# EasyEDA Pro project ECU_Project.epro, board PCB5
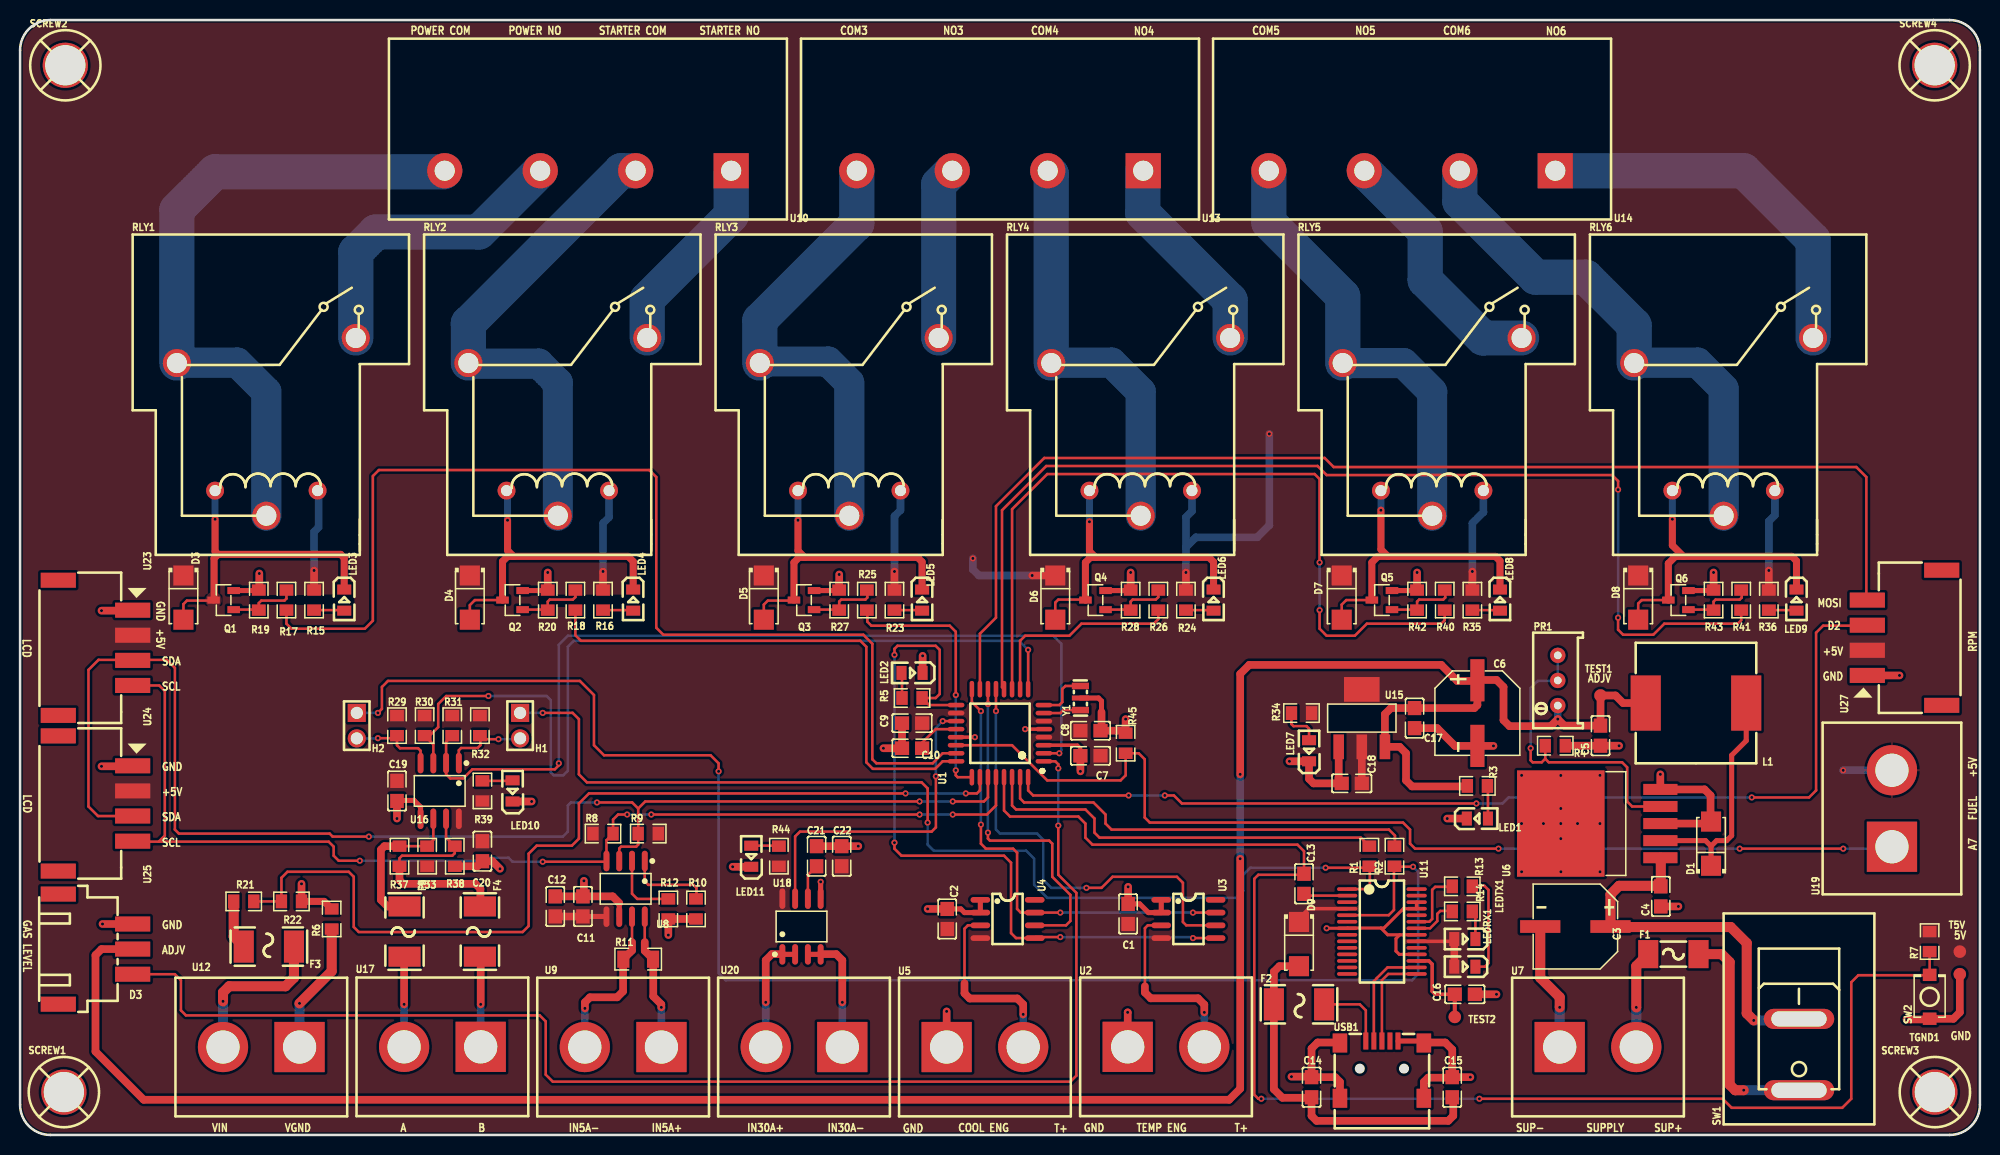
[diagram p4: board, top side]
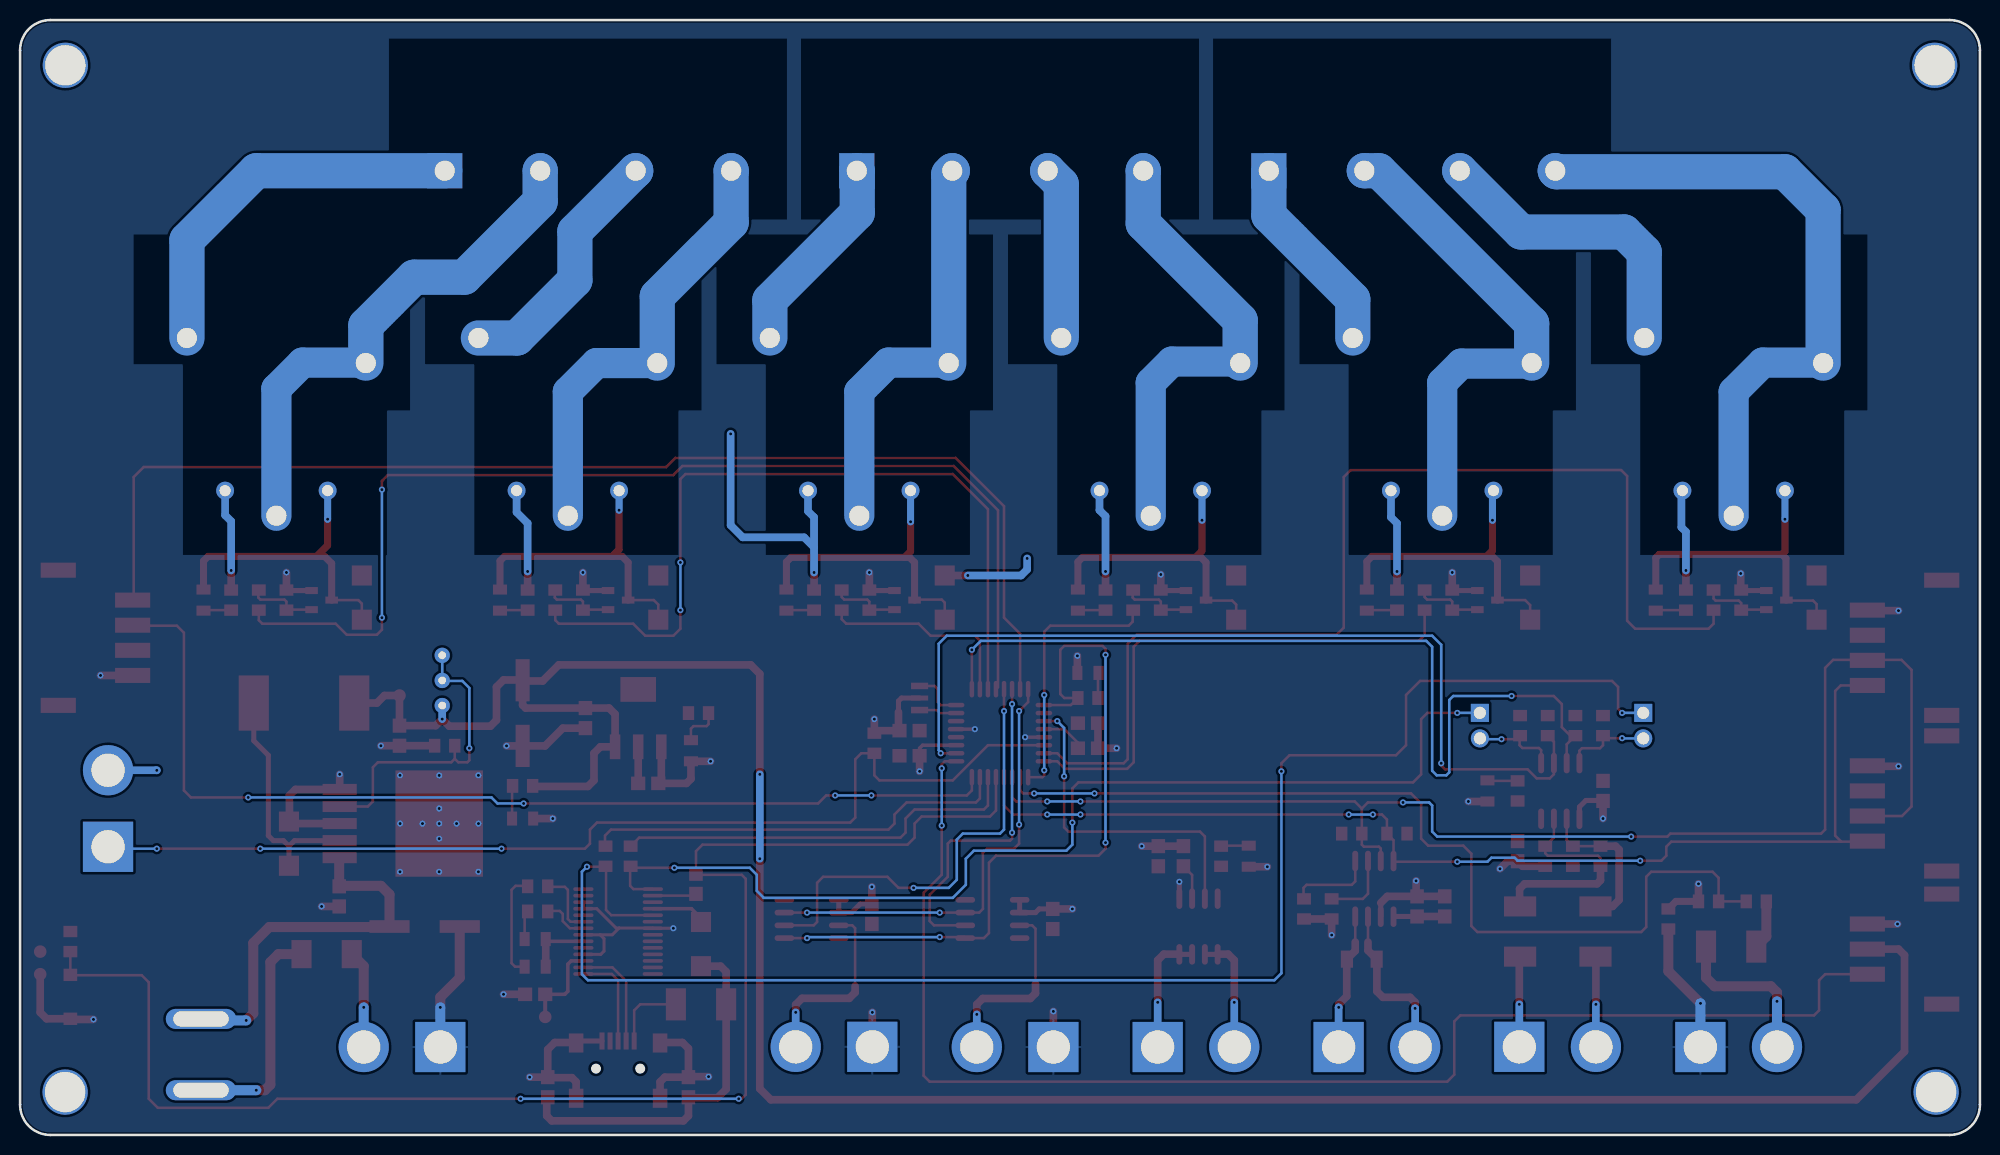
[diagram p5: board, bottom side, seen from below]

Outline 195 x 111 mm; copper layers: Top Layer, Bottom Layer. Coordinates in mm from the lower left corner of the outline.
Outline path: 0,108 0,3 arc(0.88,0.88) 3,0 192,0 arc(194.12,0.88) 195,3 195,108 arc(194.12,110.12) 192,111 3,111 arc(0.88,110.12) 0,108
Stack: Top Layer 0.035mm / Dielectric1 1.51mm FR4 er 4.5 / Bottom Layer 0.035mm

## Design rules (mm)
template: Custom Config
spacing copperThickness1oz (default): track to track 0.254, other pairs 0.152 to 0.3
spacing copperThickness2oz: track to track 0.203, other pairs 0.152 to 0.3
track width copperThickness1oz (default): min 0.127, default 0.254, max 4.1
track width copperThickness2oz: min 0.203, default 0.762, max 2.54
differential pair differentialPair (default): width min 0.127, default 0.254, max 2.54; gap min 0.152, default 0.152
via viaSize (default): diameter min 0.5, default 0.61, max 10; hole min 0.3, default 0.305, max 6.3
net +5V uses copperThickness2oz
net GND uses copperThickness2oz
net +ADJV uses copperThickness2oz

## Placement (name value [footprint] x y rotation side)
C1  100nF  [C0805]  110.25 22 270 top
C2  100nF  [C0805]  92.25 21.5 270 top
C3  100uF  [CAP-SMD_BD8.0-L8.3-W8.3-LS10.0-FD]  154.75 20.75 180 top
C4  100nF  [C0805]  163.25 23.75 90 top
C5  100nF  [C0805]  157.25 39.75 90 top
C6  220uF  [CAP-SMD_BD8.0-L8.3-W8.3-FD]  145 42 270 top
C7  1uF  [C0805]  106.5 37.75 0 top
C8  4.7uF  [C0805]  106.5 40.25 180 top
C9  1uF  [C0805]  88.75 41 0 top
C10  100nF  [C0805]  88.75 38.5 0 top
C11  10uF  [C0805]  56 22.75 270 top
C12  100nF  [C0805]  53.25 22.75 270 top
C13  100nF  [C0805]  127.75 25 270 top
C14  4.7uF  [C0805]  128.5 4.75 270 top
C15  100nF  [C0805]  142.5 4.75 270 top
C16  100nF  [C0805]  143.75 14 180 top
C17  22uF  [C0805]  138.75 41.5 90 top
C18  22uF  [C0805]  132.5 35 0 top
C19  10uF  [C0805]  37.5 34.25 90 top
C20  100nF  [C0805]  46 28.25 90 top
C21  1nF  [C0805]  79.25 27.75 270 top
C22  100nF  [C0805]  81.75 27.75 270 top
D1  SS34  [SMA_L4.3-W2.6-LS5.2-RD]  168.25 29 90 top
D3  SS34  [SMA_L4.3-W2.6-LS5.2-RD]  16.25 53.5 270 top
D4  SS34  [SMA_L4.3-W2.6-LS5.2-RD]  44.75 53.5 270 top
D5  SS34  [SMA_L4.3-W2.6-LS5.2-RD]  74 53.5 270 top
D6  SS34  [SMA_L4.3-W2.6-LS5.2-RD]  103 53.5 270 top
D7  SS34  [SMA_L4.3-W2.6-LS5.2-RD]  131.5 53.5 270 top
D8  SS34  [SMA_L4.3-W2.6-LS5.2-RD]  161 53.5 270 top
D9  SS34  [SMA_L4.3-W2.6-LS5.2-RD]  127.25 19 270 top
F1  TA2VT3  [FUSE-SMD_L6.1-W2.5]  164.5 18 0 top
F2  TA2VT1  [F2410]  127.25 13 0 top
F3  TA2VT1  [F2410]  24.75 18.75 180 top
F4  TA2VT1  [F2410]  45.75 20.25 270 top
F5  TA2VT1  [F2410]  38.25 20.25 270 top
H1  -  [HDR-TH_2P-P2.54-V-M-2]  49.75 40.75 180 top
H2  -  [HDR-TH_2P-P2.54-V-M-2]  33.5 40.75 180 top
L1  47uH  [IND-SMD_L12.0-W12.0_CDRH127NP]  166.75 43 180 top
LED1  KT-0805W  [LED0805-R-RD]  145 31.5 0 top
LED2  KT-0805G  [LED0805-R-RD]  88.75 46 180 top
LED3  KT-0805W  [LED0805-R-RD]  32.25 53.25 270 top
LED4  KT-0805W  [LED0805-R-RD]  61 53.25 270 top
LED5  KT-0805W  [LED0805-R-RD]  89.75 53.25 270 top
LED6  KT-0805W  [LED0805-R-RD]  118.75 53.25 270 top
LED7  KT-0805W  [LED0805-R-RD]  128.25 38.25 90 top
LED8  KT-0805W  [LED0805-R-RD]  147.25 53.25 270 top
LED9  KT-0805W  [LED0805-R-RD]  176.75 53.25 270 top
LED10  KT-0805G  [LED0805-R-RD]  49 34.25 90 top
LED11  KT-0805W  [LED0805-R-RD]  72.75 27.75 90 top
LEDRX1  KT-0805Y  [LED0805-R-RD]  143.75 16.75 180 top
LEDTX1  KT-0805Y  [LED0805-R-RD]  143.75 19.5 180 top
PR1  10kΩ  [RES-ADJ-TH_3P-L10.0-W10.0-P2.50-L]  153 45.25 90 top
Q1  AO3400A  [SOT-23-3_L2.9-W1.3-P1.90-LS2.4-BR]  20.25 53.25 0 top
Q2  AO3400A  [SOT-23-3_L2.9-W1.3-P1.90-LS2.4-BR]  49 53.25 0 top
Q3  AO3400A  [SOT-23-3_L2.9-W1.3-P1.90-LS2.4-BR]  78 53.25 0 top
Q4  AO3400A  [SOT-23-3_L2.9-W1.3-P1.90-LS2.4-BR]  107 53.25 0 top
Q5  AO3400A  [SOT-23-3_L2.9-W1.3-P1.90-LS2.4-BR]  135.5 53.25 0 top
Q6  AO3400A  [SOT-23-3_L2.9-W1.3-P1.90-LS2.4-BR]  165 53.25 0 top
R1  1kΩ  [R0805]  134.25 27.75 90 top
R2  1kΩ  [R0805]  136.75 27.75 90 top
R3  1kΩ  [R0805]  145 34.75 180 top
R4  330Ω  [R0805]  152.75 38.75 180 top
R5  1kΩ  [R0805]  88.75 43.5 0 top
R6  1kΩ  [R0805]  31 21.5 90 top
R7  1kΩ  [R0805]  190 19.25 90 top
R8  10kΩ  [R0805]  58 30 0 top
R9  10kΩ  [R0805]  62.5 30 0 top
R10  10kΩ  [R0805]  67.25 22.5 270 top
R11  100mΩ  [R1206]  61.5 17.5 0 top
R12  10kΩ  [R0805]  64.5 22.5 270 top
R13  1kΩ  [R0805]  143.5 24.75 0 top
R14  1kΩ  [R0805]  143.5 22.25 0 top
R15  1kΩ  [R0805]  29.25 53.25 90 top
R16  1kΩ  [R0805]  58 53.25 90 top
R17  1kΩ  [R0805]  26.5 53.25 90 top
R18  1kΩ  [R0805]  55.25 53.25 90 top
R19  10kΩ  [R0805]  23.75 53.25 90 top
R20  10kΩ  [R0805]  52.5 53.25 90 top
R21  68kΩ  [R0805]  22.25 23.25 180 top
R22  7.5kΩ  [R0805]  27 23.25 180 top
R23  1kΩ  [R0805]  87 53.25 90 top
R24  1kΩ  [R0805]  116 53.25 90 top
R25  1kΩ  [R0805]  84.25 53.25 90 top
R26  1kΩ  [R0805]  113.25 53.25 90 top
R27  10kΩ  [R0805]  81.5 53.25 90 top
R28  10kΩ  [R0805]  110.5 53.25 90 top
R29  10kΩ  [R0805]  37.5 40.75 90 top
R30  10kΩ  [R0805]  40.25 40.75 90 top
R31  10kΩ  [R0805]  43 40.75 90 top
R32  10kΩ  [R0805]  45.75 40.75 90 top
R33  20kΩ  [R0805]  40.5 27.75 270 top
R34  1kΩ  [R0805]  127.5 42 0 top
R35  1kΩ  [R0805]  144.5 53.25 90 top
R36  1kΩ  [R0805]  174 53.25 90 top
R37  120Ω  [R0805]  37.75 27.75 90 top
R38  20kΩ  [R0805]  43.25 27.75 90 top
R39  1kΩ  [R0805]  46 34.25 270 top
R40  1kΩ  [R0805]  141.75 53.25 90 top
R41  1kΩ  [R0805]  171.25 53.25 90 top
R42  10kΩ  [R0805]  139 53.25 90 top
R43  10kΩ  [R0805]  168.5 53.25 90 top
R44  1kΩ  [R0805]  75.5 27.75 270 top
R45  220Ω  [R0805]  110 39 90 top
RLY1  SLA-5VDC-SL-A  [RELAY-TH_SLA-XXVDC-SL-A]  24.5 70.5 0 top
RLY2  SLA-5VDC-SL-A  [RELAY-TH_SLA-XXVDC-SL-A]  53.5 70.5 0 top
RLY3  SLA-5VDC-SL-A  [RELAY-TH_SLA-XXVDC-SL-A]  82.5 70.5 0 top
RLY4  SLA-5VDC-SL-A  [RELAY-TH_SLA-XXVDC-SL-A]  111.5 70.5 0 top
RLY5  SLA-5VDC-SL-A  [RELAY-TH_SLA-XXVDC-SL-A]  140.5 70.5 0 top
RLY6  SLA-5VDC-SL-A  [RELAY-TH_SLA-XXVDC-SL-A]  169.5 70.5 0 top
SCREW1  -  [Screw-Hole-M4]  4.36 4.26 0 top
SCREW2  -  [Screw-Hole-M4]  4.5 106.5 0 top
SCREW3  -  [Screw-Hole-M4]  190.52 4.26 0 top
SCREW4  -  [Screw-Hole-M4]  190.5 106.5 0 top
SW1  MR1-110-C5N-BBAA  [SW-TH_MR1-110-C5N-BBAA]  177 8 90 top
SW2  TS-1088R-02026  [SW-SMD_L3.9-W3.0-P4.45]  190 13.75 90 top
T5V  -  [Test-Point-0.5mm]  193 18.25 0 top
TEST1  -  [Test-Point-0.5mm]  157.25 43.75 0 top
TEST2  -  [Test-Point-0.5mm]  142.75 11.75 0 top
TGND1  -  [Test-Point-0.5mm]  193 16 0 top
U1  ATMEGA328P-AU  [TQFP-32_L7.0-W7.0-P0.80-LS9.0-BL]  97.5 40 90 top
U2  KF25H-7.62-2P  [CONN-TH_KF25H-7.62-2P]  114.02 8.77 0 top
U3  MAX6675ISA+  [SOIC-8_L5.0-W4.0-P1.27-LS6.0-BL]  116.25 21.5 270 top
U4  MAX6675ISA+  [SOIC-8_L5.0-W4.0-P1.27-LS6.0-BL]  98.25 21.5 270 top
U5  KF25H-7.62-2P  [CONN-TH_KF25H-7.62-2P]  96 8.75 0 top
U6  LM2596S-ADJRG  [TO-263-5_L10.2-W8.6-P1.70-LS14.4-TL]  158.25 31 180 top
U7  KF25H-7.62-2P  [CONN-TH_KF25H-7.62-2P]  157 8.75 0 top
U8  INA219AIDR  [SOIC-8_L4.9-W3.9-P1.27-LS6.0-BL]  60.25 24.5 180 top
U9  KF25H-7.62-2P  [CONN-TH_KF25H-7.62-2P]  60 8.75 180 top
U10  HB9500-9.5-4P  [CONN-TH_HB9500-9.5-4P]  56.5 96 180 top
U11  FT232RL  [SSOP-28_L10.2-W5.3-P0.65-LS7.8-BL]  135.5 20.25 270 top
U12  KF25H-7.62-2P  [CONN-TH_KF25H-7.62-2P]  24 8.75 180 top
U13  HB9500-9.5-4P  [CONN-TH_HB9500-9.5-4P]  97.5 96 180 top
U14  HB9500-9.5-4P  [CONN-TH_HB9500-9.5-4P]  138.5 96 180 top
U15  AMS1117-5.0  [SOT-223_L6.5-W3.5-P2.30-LS7.0-BR]  133.5 41.5 270 top
U16  MAX485CSA+T  [SOIC-8_L4.9-W3.9-P1.27-LS6.0-BL]  41.75 34.25 180 top
U17  KF25H-7.62-2P  [CONN-TH_KF25H-7.62-2P]  42.02 8.77 180 top
U18  ACS712ELCTR-20A-T  [SOIC-8_L4.9-W3.9-P1.27-LS6.0-BL]  77.75 20.75 0 top
U19  KF25H-7.62-2P  [CONN-TH_KF25H-7.62-2P]  186.25 32.5 90 top
U20  KF25H-7.62-2P  [CONN-TH_KF25H-7.62-2P]  78 8.75 180 top
U23  BX-XH2.54-4PWT  [CONN-SMD_4P-P2.50_BX-XH2.54-4PWT]  7.5 48.5 270 top
U24  BX-XH2.54-4PWT  [CONN-SMD_4P-P2.50_BX-XH2.54-4PWT]  7.5 33 270 top
U25  BX-XH2.54-3PWT  [CONN-SMD_3P-P2.50_BX-XH2.54-3PWT]  7.5 18.5 270 top
U27  BX-XH2.54-4PWT  [CONN-SMD_4P-P2.50_BX-XH2.54-4PWT]  187.5 49.5 90 top
USB1  UX-144S-ACP5  [MINI-USB-SMD_UX-144S-ACP5]  135.5 6.5 0 top
Y1  16MHz  [OSC-SMD_3P-L3.2-W1.3-P1.2-L]  105.5 43.5 90 top

## Footprints (pads in the part's own frame, mm; a bottom-side part is the same pattern mirrored in y, then rotated)
C0805
  rect 1.41x1.35 smd: 1(-1,0) 2(1,0)
CAP-SMD_BD8.0-L8.3-W8.3-FD
  rect 4.2x1.4 smd: 1(-3.267,0) 2(3.267,0)
CAP-SMD_BD8.0-L8.3-W8.3-LS10.0-FD
  rect 4x1.26 smd: 1(-3.495,0) 2(3.495,0)
CONN-SMD_3P-P2.50_BX-XH2.54-3PWT
  rect 1.5x3.5 smd: 1(-2.5,3.7) 2(0,3.7) 3(2.5,3.7) 4(5.48,-3.7) 5(-5.48,-3.7)
CONN-SMD_4P-P2.50_BX-XH2.54-4PWT
  rect 1.5x3.5 smd: 1(-3.75,3.7) 2(-1.25,3.7) 3(1.25,3.7) 4(3.75,3.7) 5(6.73,-3.7) 6(-6.73,-3.7)
CONN-TH_HB9500-9.5-4P
  rect 3.5x3.5 hole 2: 1(-14.25,0)
  round 3.5 hole 2: 2(-4.75,0) 3(4.75,0) 4(14.25,0)
CONN-TH_KF25H-7.62-2P
  rect 5x5 hole 3.3: 1(-3.81,0)
  round 5 hole 3.3: 2(3.81,0)
F2410
  rect 2x3.2 smd: 1(-2.5,0) 2(2.5,0)
FUSE-SMD_L6.1-W2.5
  rect 2x2.8 smd: 1(-2.5,0) 2(2.5,0)
HDR-TH_2P-P2.54-V-M-2
  rect 1.8x1.8 hole 1.2: 1(0,-1.27)
  round 1.8 hole 1.2: 2(0,1.27)
IND-SMD_L12.0-W12.0_CDRH127NP
  rect 3x5.5 smd: 1(-5,0) 2(5,0)
LED0805-R-RD
  rect 1x1.399 smd: 1(1.05,0) 2(-1.05,0)
MINI-USB-SMD_UX-144S-ACP5
  rect 0.5x1.7 smd: 1(-1.6,2.85) 2(-0.8,2.85) 3(0,2.85) 4(0.8,2.85) 5(1.6,2.85)
  rect 1.45x1.9 smd: 6(-4.175,2.65) 7(-4.175,-2.85) 8(4.175,-2.85) 9(4.175,2.65)
OSC-SMD_3P-L3.2-W1.3-P1.2-L
  rect 0.65x1.7 smd: 1(-1.2,0) 3(1.2,0)
  rect 0.5x1.7 smd: 2(0,0)
R0805
  rect 1.133x1.377 smd: 1(-1,0) 2(1,0)
R1206
  rect 1.208x1.701 smd: 1(-1.479,0) 2(1.479,0)
RELAY-TH_SLA-XXVDC-SL-A
  round 2.794 hole 2.002: 2(8.9,8.85)
  round 1.778 hole 1.103: 3(5.1,-6.349) 4(-5.1,-6.349)
  round 2.794 hole 2: 5(-8.9,6.351) 5(0,-8.85)
RES-ADJ-TH_3P-L10.0-W10.0-P2.50-L
  round 1.524 hole 0.762: 1(-2.5,0) 2(0,0) 3(2.5,0)
Screw-Hole-M4
  round 4.5 hole 4: 1(0,0)
SMA_L4.3-W2.6-LS5.2-RD
  rect 2x2 smd: 1(-2.2,0) 2(2.2,0)
SOIC-8_L4.9-W3.9-P1.27-LS6.0-BL
  oval 0.588x2.045 smd: 1(-1.905,-2.772) 2(-0.635,-2.772) 3(0.635,-2.772) 4(1.905,-2.772) 5(1.905,2.772) 6(0.635,2.772) 7(-0.635,2.772) 8(-1.905,2.772)
SOIC-8_L5.0-W4.0-P1.27-LS6.0-BL
  oval 0.569x1.95 smd: 1(-1.905,-2.705) 2(-0.635,-2.705) 3(0.635,-2.705) 4(1.905,-2.705) 5(1.905,2.705) 6(0.635,2.705) 7(-0.635,2.705) 8(-1.905,2.705)
SOT-23-3_L2.9-W1.3-P1.90-LS2.4-BR
  rect 1.25x0.7 smd: 1(1,-0.95) 2(1,0.95) 3(-1,0)
SOT-223_L6.5-W3.5-P2.30-LS7.0-BR
  rect 2.465x1.05 smd: 1(2.857,-2.3) 2(2.857,0) 3(2.857,2.3)
  rect 2.465x3.54 smd: 4(-2.857,0)
SSOP-28_L10.2-W5.3-P0.65-LS7.8-BL
  oval 0.364x2.015 smd: 1(-4.225,-3.455) 2(-3.575,-3.455) 3(-2.925,-3.455) 4(-2.275,-3.455) 5(-1.625,-3.455) 6(-0.975,-3.455) 7(-0.325,-3.455) 8(0.325,-3.455) 9(0.975,-3.455) 10(1.625,-3.455) 11(2.275,-3.455) 12(2.925,-3.455) 13(3.575,-3.455) 14(4.225,-3.455) 15(4.225,3.455) 16(3.575,3.455) 17(2.925,3.455) 18(2.275,3.455) 19(1.625,3.455) 20(0.975,3.455) 21(0.325,3.455) 22(-0.325,3.455) 23(-0.975,3.455) 24(-1.625,3.455) 25(-2.275,3.455) 26(-2.925,3.455) 27(-3.575,3.455) 28(-4.225,3.455)
SW-SMD_L3.9-W3.0-P4.45
  rect 1.23x1.36 smd: 1(-2.185,0) 2(2.185,0)
SW-TH_MR1-110-C5N-BBAA
  oval 2x7 hole 1.5x5.5: 1(-3.55,0) 2(3.55,0)
Test-Point-0.5mm
  round 1.25 smd: 1(0,0)
TO-263-5_L10.2-W8.6-P1.70-LS14.4-TL
  rect 3.4x1.1 smd: 1(-4.953,3.4) 2(-4.953,1.7) 3(-4.953,0) 4(-4.953,-1.7) 5(-4.953,-3.4)
  rect 8.705x10.587 smd: 6(4.953,0)
TQFP-32_L7.0-W7.0-P0.80-LS9.0-BL
  oval 0.45x1.65 smd: 1(-2.8,-4.369) 2(-2,-4.369) 3(-1.2,-4.369) 4(-0.4,-4.369) 5(0.4,-4.369) 6(1.2,-4.369) 7(2,-4.369) 8(2.8,-4.369) 17(2.8,4.369) 18(2,4.369) 19(1.2,4.369) 20(0.4,4.369) 21(-0.4,4.369) 22(-1.2,4.369) 23(-2,4.369) 24(-2.8,4.369)
  oval 1.65x0.45 smd: 9(4.381,-2.8) 10(4.381,-2) 11(4.381,-1.2) 12(4.381,-0.4) 13(4.381,0.4) 14(4.381,1.2) 15(4.381,2) 16(4.381,2.8) 25(-4.381,2.8) 26(-4.381,2) 27(-4.381,1.2) 28(-4.381,0.4) 29(-4.381,-0.4) 30(-4.381,-1.2) 31(-4.381,-2) 32(-4.381,-2.8)

## Nets
As in the schematic.

Pads without a net: SCREW1 1; SCREW2 1; SCREW3 1; SCREW4 1; U3 8; U4 8; U11 3 6 8 9 10 11 12 13 14 19 24 27 28; U23 5 6; U24 5 6; U25 4 5; U27 5 6; USB1 4

## Via types
v1: diameter 0.61, hole 0.305, Top Layer to Bottom Layer, 142 vias

## Routing (per net, layer and track width the routed paths; a pad name or vN(x,y) marks a point on that pad's centre or on a via; arc(x,y) is an arc through that point)
+3.3V: length 9
  Top Layer w0.35: C16.2 140.8,14 140.5,14.3 140.5,17 140.18,17.32 U11.17
  Top Layer w0.4: C16.2 TEST2.1
+5V: length 114.7
  Top Layer w0.35: D9.1 127.25,21.57 128.2,22.53 U11.4 ; U11.20 142.47,19.28 LEDTX1.1
  Top Layer w0.502: C11.2 58.32,21.75 U8.5
  Top Layer w0.762: LEDRX1.1 LEDTX1.1 ; R36.2 v1(174,56.2) ; C12.2 C11.2 ; R15.2 v1(29.25,56.2) ; U15.2 C18.2 ; R24.2 v1(116,56) ; D6.1 v1(100.7,55.7) ; R23.2 v1(87,56.1) ; R16.2 v1(58,56.1) ; R35.2 v1(144.5,56.1)
  Bottom Layer w0.762: RLY6.3 174.6,61.7 174,61.1 v1(174,56.2) ; RLY5.3 145.6,62 144.5,60.9 v1(144.5,56.1) ; v1(58,56.1) 58,60.9 58.6,61.5 RLY2.3 ; v1(100.7,55.7) 95.4,55.7 94.8,56.3 v1(94.8,57.4) ; v1(181.4,36.3) 181.41,36.31 U19.2 ; RLY1.3 29.7,64.05 29.7,60.5 29.25,60.05 v1(29.25,56.2) ; v1(87,56.1) 87,61.6 87.6,62.2 RLY3.3 ; 116,58.51 116,61.5 116.6,62.1 RLY4.3 ; 116,58.51 v1(116,56) ; 116,58.51 116.99,59.5 123.1,59.5 124.3,60.7 v1(124.3,69.8)
GND: length 248.5
  Top Layer w0.3: v1(130,20.57) U11.7 132.07,20.6 135.4,20.6 ; U11.18 137.22,17.97 136.9,18.3 136.9,19.54 137.28,19.93 ; 135.4,20.6 136.07,19.93 137.28,19.93 ; 135.4,20.6 135.7,20.6 137.62,22.53 U11.25 ; 137.28,19.93 U11.21
  Top Layer w0.35: C7.1 105.5,38.5 105.2,38.8 U1.3 ; U1.5 v1(100,40.4) ; U1.21 v1(95,39.6) ; U11.26 U11.25
  Top Layer w0.5: R20.2 52.45,54.2 Q2.2 ; 107.6,42.1 107.6,43.2 107.3,43.5 Y1.2
  Top Layer w0.502: C2.1 93.6,22.5 93.97,22.13 U4.2 U4.1 ; C19.1 37.55,33.3 39.2,33.3 39.84,32.66 U16.5 ; Q1.2 23.7,54.2 ; C1.1 111.4,23 112.26,22.13 U3.2 U3.1 ; U18.5 v1(79.66,25.2) ; 59.61,23.1 U8.6
  Top Layer w0.508: Q5.2 138.95,54.2 R42.2 ; R28.2 110.45,54.2 Q4.2 ; Q3.2 81.45,54.2 R27.2 ; Q6.2 168.45,54.2 R43.2 ; USB1.5 139.47,9.35 USB1.9
  Top Layer w0.7: R6.2 30.25,23.25 R22.1
  Top Layer w0.762: v1(187.7,11.5) 189.94,11.5 SW2.1 192.37,11.56 193,12.2 TGND1.1 ; U5.1 v1(92.19,12.3) ; 107.6,42.1 107.6,40.35 C8.1 109.75,40.25 R45.2 v1(110,41.4) ; U6.3 168.05,31 D1.2 168.2,31.25 168.2,33.8 167.6,34.4 U6.5 v1(163.2,35.9) ; v1(47.75,26.5) 47,27.25 C20.1 45.5,26.75 R38.1 ; C15.1 142.45,5.7 140.1,5.7 139.68,5.28 USB1.8 ; C15.1 142.5,8.5 141.8,9.2 139.72,9.2 USB1.9 ; C15.1 v1(144.3,5.75) ; C14.1 128.45,5.8 v1(126.5,5.8) ; C14.1 128.5,8.6 129.1,9.2 131.28,9.2 USB1.6 ; C14.1 130.85,5.75 131.32,5.28 USB1.7 ; U2.1 110.21,12.19 v1(110.2,12.2) ; R19.2 23.8,54.3 v1(23.8,55.9) ; R27.2 v1(81.5,55.8) ; LED1.2 v1(142,31.5) ; 59.61,23.1 58.97,23.75 C11.1 ; C7.1 v1(105.5,36.2) ; LED11.2 v1(70.9,26.7) ; C4.1 v1(165,22.75) ; C17.1 141,40.5 142.77,38.73 C6.2 v1(146.6,38.73) ; U23.1 11.15,52.2 v1(8.1,52.2) ; C11.1 56.1,23.85 v1(56.1,25.3) ; C11.1 C12.1 ; C1.1 v1(110.25,24.7) ; R20.2 v1(52.5,56) ; R43.2 v1(168.5,56) ; C19.1 v1(37.5,31.5) ; C21.1 C22.1 v1(83.4,28.75) ; U15.1 131.2,35.3 C18.1 128.7,35 128.25,35.45 LED7.2 v1(126.3,37.2) ; R10.2 R12.2 v1(64.5,19.9) ; C16.1 v1(146.9,14) ; v1(8.1,36.7) 11.15,36.7 U24.1 ; R4.1 C5.1 v1(159.1,38.75) ; C9.1 C10.1 v1(85.9,38.5) ; R22.1 v1(28,25) ; R28.2 v1(110.5,56) ; LED10.2 v1(50.9,33.2) ; LED2.2 v1(89.8,47.7) ; U25.1 v1(8.2,21) ; U27.1 v1(187,45.75) ; R42.2 v1(139,56) ; C2.1 v1(90.3,22.5)
  Top Layer w1: C3.2 151.25,15.65 153.19,13.71 v1(153.19,12.7) ; v1(27.8,13.1) 31,16.3 R6.1
  Bottom Layer w1: U12.1 27.81,13.09 v1(27.8,13.1) ; U7.1 v1(153.19,12.7)
  vias: v1(149.4,35.8) v1(149.39,31) v1(149.4,26.2) v1(151.57,31) v1(153.3,35.79) v1(153.3,32.5) v1(153.3,31) v1(153.3,29.5) v1(153.31,26.2) v1(154.96,31) v1(157.2,35.8) v1(157.19,31) v1(157.2,26.2)
+ADJV: length 248.7
  Top Layer w0.762: 145,45.2 143,45.2 141.4,46.8 122.3,46.8 121.4,45.9 v1(121.4,35.9) ; 145,45.2 145.18,45.2 145.28,45.3 ; 145,45.2 145,42.8 144.7,42.5 C17.2 136.4,42.5 135.8,41.9 U15.3 137.26,38.64 137.9,38 137.9,35.3 138.5,34.7 143.95,34.7 R3.2 ; 145,45.2 C6.1 145.03,45.3 145.28,45.3 ; 145.28,45.3 146.9,45.3 147.6,44.6 147.6,41.3 148.2,40.7 152.3,40.7 v1(153,41.4) 153.65,40.75 C5.2 TEST1.1 158.75,43.75 159.5,43 L1.2 ; v1(121.4,27.5) 121.4,4.6 120.3,3.5 12.3,3.5 7.5,8.3 7.5,17.9 8.1,18.5 U25.2
  Bottom Layer w0.762: PR1.1 v1(153,41.4) ; v1(121.4,27.5) v1(121.4,35.9)
A: length 15.3
  Top Layer w0.254: U16.6 41.11,29.37 R33.1 R37.2
  Top Layer w0.762: R37.2 36.25,28.75 35.9,28.4 35.9,23.4 36.55,22.75 F5.1
A0: length 111.2
  Top Layer w0.254: U1.23 91.8,38 90.8,37 85.2,37 84.8,37.4 84.8,48.9 83.9,49.8 64,49.8 63.3,50.5 63.3,65.5 62.6,66.2 35.7,66.2 35.1,65.6 35.1,51.2 34.3,50.4 27,50.4 26.5,50.9 R17.1
A1: length 52.9
  Top Layer w0.254: U1.24 91.8,37.2 91.05,36.45 84.85,36.45 84.2,37.1 84.2,48.6 83.6,49.2 55.8,49.2 55.25,49.75 R18.1
A2: length 26.4
  Top Layer w0.254: v1(93.1,36.3) 93.1,35.8 93.28,35.62 U1.25 ; v1(93.1,43.8) 93.1,50.1 92.5,50.7 84.7,50.7 84.3,51.1 84.3,52.2 R25.1
  Bottom Layer w0.254: v1(93.1,36.3) v1(93.1,43.8)
A3: length 93.7
  Top Layer w0.254: v1(88.1,34) 56.6,34 55.6,33 55.6,29.5 54.9,28.8 51.4,28.8 50.6,28 50.6,20.8 50,20.2 33.7,20.2 33.2,20.7 33.2,25.7 32.7,26.2 26.6,26.2 26,25.6 R22.2 R21.1 ; U1.26 95.5,34.3 95.2,34 v1(94.1,34)
  Bottom Layer w0.254: v1(94.1,34) v1(88.1,34)
A6: length 32.8
  Top Layer w0.254: v1(91.12,35.7) 91.12,30.62 90.7,30.2 77.6,30.2 77.12,29.72 U18.7 ; U1.19 v1(91.8,41.2)
  Bottom Layer w0.254: v1(91.8,41.2) 91.12,40.52 v1(91.12,35.7)
A7: length 105.2
  Top Layer w0.254: U1.22 98.7,38.8 102.2,35.3 109.5,35.3 110,35.8 R45.1 111.3,38 111.9,37.4 111.9,31.6 112.4,31.1 137.6,31.1 138.3,30.4 138.3,29 138.8,28.5 v1(147.1,28.5) ; v1(181.4,28.5) v1(171.1,28.5)
  Bottom Layer w0.254: U19.1 186.06,28.5 v1(181.4,28.5) ; v1(171.1,28.5) v1(147.1,28.5)
AREF: length 4.5
  Top Layer w0.254: U1.20 91.1,40.4 89.75,39.05 C10.2
B: length 21.9
  Top Layer w0.254: U16.7 42.39,29.62 R38.2 43.25,28.05 43,27.8 38,27.8 37.75,27.55 R37.1
  Top Layer w0.762: R37.1 37.75,25.35 38.1,25 45.3,25 45.8,24.5 45.8,22.8 F4.1
COM1: length 66
  Bottom Layer w3: RLY1.5 24.5,74 21.6,76.9 15.65,76.9 RLY1.5
  Bottom Layer w3.5: U10.4 42.15,95.9 19.4,95.9 15.6,92.1 RLY1.5
COM2: length 49.9
  Bottom Layer w3: RLY2.5 53.5,74.9 51.6,76.8 44.65,76.8 RLY2.5
  Bottom Layer w3.5: U10.2 59.8,96 44.6,80.8 RLY2.5
COM3: length 46.2
  Bottom Layer w3: RLY3.5 73.75,77 80.4,77 82.5,74.9 RLY3.5
  Bottom Layer w3.5: RLY3.5 73.6,81.1 83.25,90.75 U13.4
COM4: length 41.8
  Bottom Layer w3: RLY4.5 102.65,76.9 108.6,76.9 111.5,74 RLY4.5
  Bottom Layer w3.5: RLY4.5 102.6,95.65 U13.2
COM5: length 44.6
  Bottom Layer w3: RLY5.5 140.5,74 137.65,76.85 RLY5.5
  Bottom Layer w3.5: RLY5.5 131.6,83.5 124.25,90.85 U14.4
COM6: length 51.9
  Bottom Layer w3: RLY6.5 169.5,74.3 166.9,76.9 160.65,76.9 RLY6.5
  Bottom Layer w3.5: RLY6.5 160.6,80.6 155.8,85.4 150.8,85.4 143.25,92.95 U14.2
D2: length 101.9
  Top Layer w0.254: v1(110.3,33.8) 100.8,33.8 100.3,34.3 U1.32 ; v1(172.3,33.6) 178,33.6 178.7,34.3 178.7,50 179.4,50.7 183.75,50.7 U27.3 ; v1(113.9,33.8) 114.8,33.8 115.6,33 v1(144.9,33)
  Bottom Layer w0.254: v1(110.3,33.8) v1(113.9,33.8) ; v1(172.3,33.6) 148.1,33.6 147.5,33 v1(144.9,33)
D3: length 136.7
  Top Layer w0.254: v1(103.3,30.8) 103.3,25.9 105.1,24.1 105.1,5.9 104.5,5.3 53,5.3 52.3,6 52.3,11.3 51.7,11.9 16.5,11.9 16,12.4 16,15.4 15.4,16 U25.3 ; U1.1 103,37.2 103.3,36.9 v1(103.3,36.5)
  Bottom Layer w0.254: v1(103.3,36.5) v1(103.3,30.8)
D4: length 91.2
  Top Layer w0.254: v1(103.4,38) U1.2 ; v1(53.6,37) 53.6,36.8 53.2,36.4 45,36.4 44.1,35.5 42.8,35.5 42.39,35.92 U16.2 42.39,39.14 R31.1
  Bottom Layer w0.254: v1(103.4,38) 103.4,38.1 103.6,38.3 103.6,48.9 102.8,49.7 54.5,49.7 53.6,48.8 v1(53.6,37)
D5: length 90.7
  Top Layer w0.254: U16.3 41.11,38.89 R30.1 40.75,39.75 41.6,40.6 41.6,42.9 42.4,43.7 v1(46.6,43.7) ; v1(100.3,48.3) U1.9
  Bottom Layer w0.254: v1(46.6,43.7) 52.4,43.7 52.8,43.3 52.8,36.1 53.1,35.8 54.05,35.8 54.5,36.25 54.5,48.6 55.09,49.19 99.41,49.19 v1(100.3,48.3)
D6: length 20.4
  Top Layer w0.254: U1.10 99.5,49.2 100,49.7 104.4,49.7 105.6,50.9 112.8,50.9 113.25,51.35 R26.1
D7: length 79.5
  Top Layer w0.254: v1(129.3,52.25) 129.3,50.4 130,49.7 132.8,49.7 134,50.9 141.4,50.9 141.75,51.25 R40.1 ; v1(129.3,57) 129.3,65.3 128.8,65.8 102.2,65.8 98.7,62.3 U1.11
  Bottom Layer w0.254: v1(129.3,57) v1(129.3,52.25)
D8: length 110.5
  Top Layer w0.254: R41.1 171.25,51.25 170.9,50.9 163.6,50.9 162.5,49.8 159.5,49.8 159,50.3 v1(159,51.5) ; U1.12 97.7,44.58 97.7,62.2 102.1,66.6 129.1,66.6 130,65.7 158.4,65.7 159,65.1 v1(159,64.25)
  Bottom Layer w0.254: v1(159,64.25) v1(159,51.5)
D9: length 45.3
  Top Layer w0.254: v1(106.1,24.6) 107.6,24.6 108.7,25.7 115.1,25.7 115.7,25.1 115.7,21.2 116.03,20.87 U3.6 ; U1.13 v1(97.1,42.2)
  Bottom Layer w0.254: v1(97.1,42.2) 97.1,30.4 97.5,30 101.2,30 101.8,29.4 101.8,25.4 102.6,24.6 v1(106.1,24.6)
D10: length 33.7
  Top Layer w0.254: U4.6 104.06,20.87 104.5,21.3 104.5,23.9 102.7,25.7 102.7,29 102.4,29.3 96.5,29.3 96.3,29.5 v1(96.3,30.1) ; U1.14 v1(96.3,42.9)
  Bottom Layer w0.254: v1(96.3,42.9) v1(96.3,30.1)
D+: length 9.8
  Top Layer w0.254: U11.15 136.12,16.03 135.5,15.4 USB1.3
D-: length 10.8
  Top Layer w0.254: U11.16 136.06,16.68 134.99,15.61 134.99,15.59 134.7,15.3 USB1.2
INA+: length 13.7
  Top Layer w0.254: U8.8 62.16,19.2
  Top Layer w0.762: v1(63.8,12.7) 63.8,13 63,13.8 63,17.48 R11.2 62.16,18.32 62.16,19.2
  Bottom Layer w0.762: U9.1 63.81,12.69 v1(63.8,12.7)
INA-: length 16.5
  Top Layer w0.254: U8.7 60.89,19.2
  Top Layer w0.762: v1(56.2,12.6) 56.2,13.2 56.7,13.7 59.4,13.7 60,14.3 60,17.48 R11.1 60.89,18.36 60.89,19.2
  Bottom Layer w0.762: U9.2 56.19,12.59 v1(56.2,12.6)
IP+: length 11.8
  Top Layer w0.508: U18.1 U18.2
  Top Layer w0.762: U18.1 75.82,18 74.8,18 74.19,17.39 v1(74.19,13.2)
  Bottom Layer w0.762: U20.2 v1(74.19,13.2)
IP-: length 12.3
  Top Layer w0.508: U18.3 U18.4
  Top Layer w0.762: U18.4 79.68,18 81.2,18 81.81,17.39 v1(81.81,13.2)
  Bottom Layer w0.762: U20.1 v1(81.81,13.2)
MISO: length 45.2
  Top Layer w0.254: U1.16 94.7,43.1 v1(95.6,42.2) ; v1(103.5,22.13) U4.7 99.56,22.13 99.2,22.5 99.2,28.1 98.8,28.5 96.1,28.5 95.6,29 v1(95.6,30.9) ; v1(116.7,22.13) U3.7
  Bottom Layer w0.254: v1(95.6,42.2) v1(95.6,30.9) ; v1(103.5,22.13) v1(116.7,22.13)
MOSI: length 120.5
  Top Layer w0.254: U27.4 183.7,53.35 183.7,65.5 182.7,66.5 130.7,66.5 129.8,67.4 101.9,67.4 97.1,62.6 97.1,51.5 95.5,49.9 U1.15
NO1: length 30.3
  Bottom Layer w3.5: U10.3 45.65,89.9 35.4,89.9 33.4,87.9 RLY1.2
NO2: length 20.1
  Bottom Layer w3.5: U10.1 70.75,91.55 62.4,83.2 RLY2.2
NO3: length 17.2
  Bottom Layer w3.5: RLY3.2 91.4,94.65 U13.3
NO4: length 20.3
  Bottom Layer w3.5: RLY4.2 120.4,83.1 111.7,91.8 111.7,95.95 U13.1
NO5: length 25.4
  Bottom Layer w3.5: U14.3 139.8,89.95 139.8,85.1 145.55,79.35 RLY5.2
NO6: length 38.3
  Bottom Layer w3.5: RLY6.2 178.4,89.1 171.5,96 U14.1
RESET: length 146.9
  Top Layer w0.254: U1.29 97.9,32.3 98.5,31.7 105.3,31.7 106,31 106,29.6 106.7,28.9 127.1,28.9 127.75,28.25 C13.1 127.65,25.9 123.2,25.9 122.8,25.5 122.8,4 123.2,3.6 v1(123.5,3.6) ; v1(145.2,3.6) 169.4,3.6 170.3,2.7 181.3,2.7 182.2,3.6 182.2,15.2 182.9,15.9 189.97,15.9 SW2.2 R7.1
  Bottom Layer w0.254: v1(123.5,3.6) v1(145.2,3.6)
RX: length 106.8
  Top Layer w0.254: 134.3,26.7 134.2,26.6 v1(129.9,26.6) ; 134.3,26.7 R1.1 ; 134.3,26.7 134.3,24.8 133.97,24.47 U11.1 ; v1(52,42.02) 54.98,42.02 55.6,41.4 55.6,35.9 56.4,35.1 89.7,35.1 90.3,34.5 v1(90.3,31.1)
  Bottom Layer w0.254: v1(90.3,31.1) 90.3,28.9 90.9,28.3 100.1,28.3 100.9,27.5 100.9,24.9 102.2,23.6 121,23.6 121.7,24.3 121.7,25.9 122.4,26.6 v1(129.9,26.6) ; H1.1 v1(52,42.02)
SCK: length 74.5
  Top Layer w0.254: U1.17 90.45,42.8 R5.2 91.1,43.5 91.5,43.9 91.5,48.3 91.1,48.7 87.3,48.7 87,48.4 v1(87,47.8) ; v1(116.7,19.59) U3.5 ; v1(103.5,19.69) 101.06,19.69 U4.5 99.1,19.59 98.6,20.1 98.6,27.1 97.9,27.8 87.7,27.8 87,28.5 v1(87,29.1)
  Bottom Layer w0.254: v1(116.7,19.59) 116.6,19.69 v1(103.5,19.69) ; v1(87,29.1) v1(87,47.8)
SCL: length 113.4
  Top Layer w0.254: U24.4 11.25,29.2 13.8,29.2 ; v1(92.8,31.9) 96.2,31.9 97.1,32.8 U1.28 ; v1(60.4,31.9) 59.5,31.9 59,31.4 R8.2 58.34,29.34 U8.4 58.27,27.2 v1(52,27.2) ; v1(62.8,31.9) v1(89.5,31.9) ; 13.8,29.2 30.7,29.2 31.2,28.7 31.2,27.8 31.7,27.3 v1(33.8,27.3) ; 13.8,29.2 14.4,29.8 14.4,44.2 13.85,44.75 U23.4
  Bottom Layer w0.254: v1(89.5,31.9) v1(92.8,31.9) ; v1(33.8,27.3) 46,27.3 46.3,27.6 48.6,27.6 49,27.2 v1(52,27.2) ; v1(60.4,31.9) v1(62.8,31.9)
SDA: length 137.6
  Top Layer w0.254: v1(89.5,33.2) 62.2,33.2 61.5,32.5 ; 61.5,32.5 R9.1 61.5,28.9 61.3,28.7 59.8,28.7 59.61,28.51 U8.3 ; 61.5,32.5 60.9,33.1 v1(57.4,33.1) ; v1(34.7,29.7) 31.1,29.7 30.8,30 15.8,30 15.4,30.4 15.4,46.5 14.6,47.3 11.25,47.3 U23.3 11.15,47.3 7.8,47.3 6.8,46.3 6.8,32.7 7.75,31.75 U24.3 ; U1.27 96.3,33.6 95.9,33.2 v1(92.8,33.2)
  Bottom Layer w0.254: v1(34.7,29.7) 54,29.7 54.5,30.2 54.5,32.8 54.8,33.1 v1(57.4,33.1) ; v1(89.5,33.2) v1(92.8,33.2)
SUPPLY: length 38.2
  Top Layer w1: U6.1 163.25,27.55 C4.2 163.2,24.8 159.1,24.8 158.25,23.94 C3.1 158.29,20.7 170.2,20.7 171.8,19.1 171.8,12.1 v1(172.5,11.4)
  Bottom Layer w1: SW1.2 176.85,11.4 v1(172.5,11.4)
T1+: length 18.8
  Top Layer w0.254: U3.3 112.2,20.87 111.92,20.58 111.92,14.8
  Top Layer w0.762: v1(117.83,12.2) 117.83,12.97 117.2,13.6 112.5,13.6 111.92,14.18 111.92,14.8
  Bottom Layer w0.762: U2.2 v1(117.83,12.2)
T2+: length 18.7
  Top Layer w0.254: 93.97,15.1 93.97,20.53 94.3,20.87 U4.3
  Top Layer w0.762: v1(99.81,12) 99.81,12.99 99.22,13.58 94.48,13.58 93.97,14.1 93.97,15.1
  Bottom Layer w0.762: U5.2 v1(99.81,12)
TX: length 158
  Top Layer w0.254: v1(138.6,26.7) 136.8,26.7 R2.1 136.7,26.7 136.7,22.4 136.18,21.88 U11.5 ; v1(35.6,42.02) 36,42.42 36,44.6 36.6,45.2 55.7,45.2 57.1,43.8 57.1,38.8 58.1,37.8 68.7,37.8 69.5,37 v1(69.5,36.2)
  Bottom Layer w0.254: v1(138.6,26.7) 139.1,26.2 139.1,16 138.5,15.4 70.2,15.4 69.5,16.1 v1(69.5,36.2) ; H2.1 v1(35.6,42.02)
VOLTIN: length 4.9
  Top Layer w1: R21.2 21.25,19.75 F3.2
VUSB: length 36.8
  Top Layer w0.762: D9.2 125.3,16.8 124.75,16.25 F2.1 124.75,4.55 125.6,3.7 128.45,3.7 C14.2 128.5,1.9 129,1.4 142.1,1.4 142.6,1.9 142.6,3.65 C15.2
$1N6242: length 2.9
  Top Layer w0.254: LEDTX1.2 144.8,21.95 R14.2
$1N6243: length 10.5
  Top Layer w0.254: LEDRX1.2 145.75,16.75 146.1,17.1 146.1,24.4 145.7,24.8 144.55,24.8 R13.2
$1N6250: length 4.4
  Top Layer w0.254: C13.2 127.93,23.82 U11.2
$1N6255: length 6.7
  Top Layer w0.254: R13.1 142.45,24.7 140.8,24.7 140.5,24.4 140.5,21.5 140.22,21.22 U11.23
$1N6256: length 4.7
  Top Layer w0.254: U11.22 140.29,20.57 141.01,21.29 141.01,22.01 141.3,22.3 142.45,22.3 R14.1
$1N6275: length 3.8
  Top Layer w0.254: Y1.1 103.8,42.3 103.5,42 U1.7
$1N6282: length 5.2
  Top Layer w0.254: U1.8 103.4,42.8 103.7,43.1 103.7,44.4 104,44.7 Y1.3
$1N6300: length 31.8
  Top Layer w0.254: Q2.3 45.25,53.25 44.75,52.75 D4.2
  Top Layer w0.7: v1(48.5,61.2) 48.5,58.2 49.1,57.6 ; 49.1,57.6 48.5,57.6 48,57.1 Q2.3 ; 49.1,57.6 60.5,57.6 61,57.1 LED4.2
  Bottom Layer w0.7: v1(48.5,61.2) 48.5,64.05 RLY2.4
$1N6315: length 42.5
  Top Layer w0.254: R2.2 136.8,28.8 136.8,29.8 136.2,30.4 108.6,30.4 108,31 108,31.9 106.8,33.1 99.9,33.1 99.5,33.5 U1.31
$1N6316: length 40.9
  Top Layer w0.254: U1.30 98.7,32.8 99.1,32.4 106,32.4 106.9,31.5 106.9,30.1 107.4,29.6 133.4,29.6 R1.2
$1N6351: length 8.6
  Top Layer w0.254: R10.1 67.3,23.55 67.3,24.6 67,24.9 62.5,24.9 62.16,25.25 U8.1
$1N6373: length 16.2
  Top Layer w1: F3.1 27.25,15.65 26.4,14.8 20.8,14.8 20.19,14.19 v1(20.19,13.3)
  Bottom Layer w1: U12.2 v1(20.19,13.3)
$1N6384: length 9
  Top Layer w0.762: F4.2 45.83,17.67 v1(45.83,13)
  Bottom Layer w0.762: U17.1 v1(45.83,13)
$1N6385: length 9
  Top Layer w0.762: v1(38.21,13) 38.21,17.71 F5.2
  Bottom Layer w0.762: U17.2 v1(38.21,13)
$1N6392: length 7.1
  Top Layer w0.254: Q3.1 81.45,52.3 R27.1 81.5,53.1 81.7,53.3 84.1,53.3 84.3,53.5 84.3,54.2 R25.2
$1N6394: length 31.3
  Top Layer w0.254: D5.2 74,52.8 74.4,53.2 76.95,53.2 Q3.3
  Top Layer w0.7: 78.06,57.5 77.5,57.5 77,57 Q3.3 ; 78.06,57.5 77.4,58.16 v1(77.4,61.2) ; 78.06,57.5 89.3,57.5 89.75,57.05 LED5.2
  Bottom Layer w0.7: RLY3.4 v1(77.4,61.2)
$1N6396: length 2.8
  Top Layer w0.254: LED8.1 147.2,52.25 R35.1
$1N6399: length 31.3
  Top Layer w0.254: Q5.3 131.95,53.25 131.5,52.8 D7.2
  Top Layer w0.7: Q5.3 134.5,57 135.1,57.6 136.1,57.6 ; 136.1,57.6 146.8,57.6 147.25,57.15 LED8.2 ; 136.1,57.6 135.4,58.3 v1(135.4,62.2)
  Bottom Layer w0.7: RLY5.4 v1(135.4,62.2)
$1N6400: length 7.1
  Top Layer w0.254: Q5.1 138.95,52.3 R42.1 139,53.1 139.2,53.3 141.6,53.3 141.8,53.5 141.8,54.2 R40.2
$1N6403: length 2.8
  Top Layer w0.254: LED5.1 89.7,52.25 R23.1
$1N6404: length 8.9
  Top Layer w0.254: U16.4 39.84,38.25 39.6,38.5 37.8,38.5 37.5,38.8 R29.1 37.25,39.5 v1(35.6,39.5)
  Bottom Layer w0.254: v1(35.6,39.5) 35.58,39.48 H2.2
$1N6416: length 7
  Top Layer w0.254: R17.2 26.5,53.4 26.3,53.2 24,53.2 23.75,52.95 R19.1 23.7,52.3 Q1.1
$1N6419: length 31.7
  Top Layer w0.254: 19.2,53.2 16.6,53.2 16.25,52.85 D3.2
  Top Layer w0.7: 19.7,57.8 31.9,57.8 32.25,57.45 LED3.2 ; 19.7,57.8 19.4,58.1 v1(19.4,61.3) ; 19.7,57.8 19.3,57.4 19.3,53.3 Q1.3
  Bottom Layer w0.7: RLY1.4 v1(19.4,61.3)
$1N6422: length 8.7
  Top Layer w0.254: 45.8,39.7 45.8,38.8 45.52,38.52 43.88,38.52 43.66,38.3 U16.1 ; 45.8,39.7 46.1,39.4 v1(47.6,39.4) ; 45.8,39.7 R32.1
  Bottom Layer w0.254: v1(47.6,39.4) 49.67,39.4 H1.2
$1N6423: length 3
  Top Layer w0.254: LED10.1 48.95,35.25 R39.1
$1N6434: length 7.4
  Top Layer w0.254: USB1.1 133.9,12.4 133.3,13 F2.2
$1N6445: length 3
  Top Layer w0.254: R15.1 32.2,52.25 LED3.1
$1N6460: length 31.5
  Top Layer w0.254: Q6.3 161.35,53.25 161,52.9 D8.2
  Top Layer w0.7: v1(164.4,61.3) 164.4,58.7 165.5,57.6 ; 165.5,57.6 164.7,57.6 164,56.9 Q6.3 ; 165.5,57.6 176.3,57.6 176.75,57.15 LED9.2
  Bottom Layer w0.7: RLY6.4 v1(164.4,61.3)
$1N6462: length 2.8
  Top Layer w0.254: LED9.1 176.7,52.25 R36.1
$1N6471: length 31.4
  Top Layer w0.254: D6.2 103,53 103.3,53.3 105.95,53.3 Q4.3
  Top Layer w0.7: LED6.2 118.75,57.05 118.3,57.5 107.01,57.5 ; 107.01,57.5 106.5,57.5 106,57 Q4.3 ; 107.01,57.5 106.4,58.11 v1(106.4,61.05)
  Bottom Layer w0.7: RLY4.4 v1(106.4,61.05)
$1N6473: length 2.8
  Top Layer w0.254: R24.1 118.7,52.25 LED6.1
$1N6474: length 3
  Top Layer w0.254: LED4.1 60.95,52.25 R16.1
$1N6496: length 7.1
  Top Layer w0.254: Q6.1 168.45,52.3 R43.1 168.5,53.1 168.7,53.3 171.1,53.3 171.3,53.5 171.3,54.2 R41.2
$1N6497: length 7
  Top Layer w0.254: Q4.1 110.45,52.3 R28.1 110.5,53.1 110.7,53.3 113,53.3 113.25,53.55 R26.2
$1N6500: length 7
  Top Layer w0.254: Q2.1 52.45,52.3 R20.1 52.5,53.1 52.7,53.3 55,53.3 55.25,53.55 R18.2
$1N6504: length 7.1
  Top Layer w0.254: R12.1 61.4,23.5 60.89,24.01 U8.2
$1N6513: length 2.5
  Top Layer w0.254: LED2.1 87.75,45.95 R5.1
$1N11240: length 23.5
  Top Layer w0.5: 168.25,28.75 167.7,29.3 U6.2 ; 168.25,28.75 D1.1 ; 168.25,28.75 168.8,29.3 169.8,29.3 170.3,29.8 170.3,37.8 171.75,39.25 L1.1
$1N15311: length 31.1
  Top Layer w0.254: 151.75,37.45 151.4,37.1 150.5,37.1 150.3,37.3 v1(150.3,38.5) ; 151.75,37.45 152.1,37.1 159.4,37.1 159.9,36.6 159.9,33.2 160.4,32.7 U6.4 ; 151.75,37.45 R4.2
  Bottom Layer w0.254: v1(150.3,38.5) 150.3,44.5 151,45.2 152.95,45.2 PR1.2 PR1.3
$1N15622: length 3.3
  Top Layer w0.254: LED1.1 146.05,34.7 R3.1
$1N27340: length 9.7
  Top Layer w1: F1.1 160.81,16.81 v1(160.81,12.7)
  Bottom Layer w1: U7.2 v1(160.81,12.7)
$1N31380: length 4.2
  Top Layer w0.254: LED7.1 128.25,40.45 128,40.7 126.7,40.7 126.5,40.9 R34.1
$1N38855: length 22.8
  Top Layer w1: F1.2 169.3,18 170.1,17.2 170.1,5 170.65,4.45 v1(171.5,4.45)
  Bottom Layer w1: SW1.1 v1(171.5,4.45)
$1N39161: length 3.6
  Top Layer w0.254: C21.2 78.38,25.88 U18.6
$1N39391: length 2.8
  Top Layer w0.254: LED11.1 75.45,28.8 R44.1

## Copper pours and planes (outline as drawn; the poured copper is in the pictures)
+5V on Top Layer: 0,111 195,111 195,0 0,0
GND on Bottom Layer: 0,111 195,111 195,0 0,0

## Text on the board
Top Silkscreen Layer: VIN | VGND | A | POWER COM | B | POWER NO | IN5A- | STARTER COM | IN5A+ | STARTER NO | IN30A+ | IN30A- | COM3 | GND | NO3 | COOL ENG | COM4 | T+ | NO4 | TEMP ENG | COM5 | NO5 | COM6 | SUP- | NO6 | SUPPLY | SUP+ | RPM | FUEL | LCD | GAS LEVEL | SCL | SDA | +5V | ADJV | MOSI | D2 | A7 | D3 | 5V
